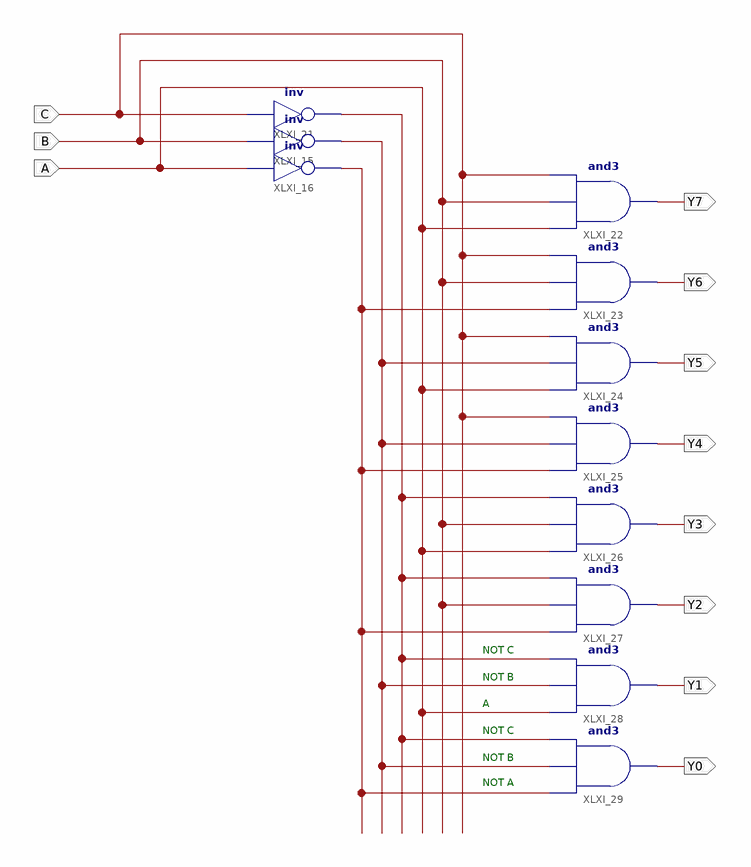
[diagram p0: schematic sheet 1]
// Xilinx ISE schematic onehot_decoder_8.sch (zynq) as structural Verilog: 11 symbols, 11 ports
module onehot_decoder_8 (
  input  C,
  input  B,
  input  A,
  output Y0,
  output Y1,
  output Y2,
  output Y3,
  output Y4,
  output Y5,
  output Y6,
  output Y7
);

  wire not_A0, not_A1, XLXN_33;

  not XLXI_21 (XLXN_33, C);
  not XLXI_15 (not_A0, B);
  not XLXI_16 (not_A1, A);
  and XLXI_22 (Y7, A, B, C);
  and XLXI_23 (Y6, not_A1, B, C);
  and XLXI_24 (Y5, A, not_A0, C);
  and XLXI_25 (Y4, not_A1, not_A0, C);
  and XLXI_26 (Y3, A, B, XLXN_33);
  and XLXI_27 (Y2, not_A1, B, XLXN_33);
  and XLXI_28 (Y1, A, not_A0, XLXN_33);
  and XLXI_29 (Y0, not_A1, not_A0, XLXN_33);

  // Notes on the sheet:
  //   NOT C
  //   NOT B
  //   A
  //   NOT C
  //   NOT B
  //   NOT A
endmodule
